# Altium schematic sheet De5.SchDoc
size A; SheetNumber: 1; SheetTotal: 1
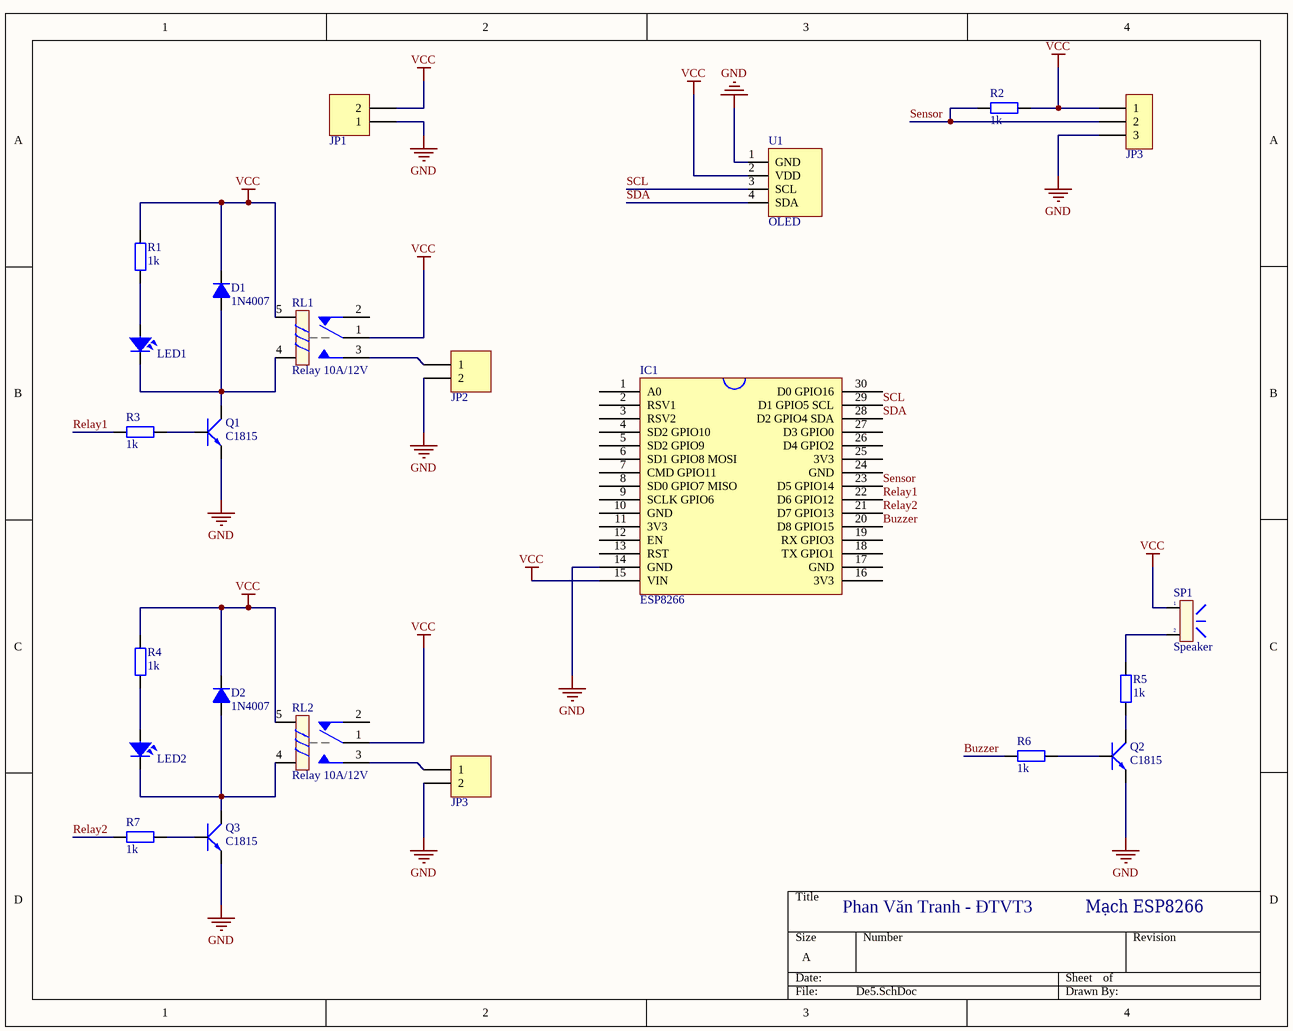
[diagram p0: De5.SchDoc]

## Parts
D1  1N4007  [D1A]
D2  1N4007  [D1A]
DHT11  JP3  [Header 3P DC 2.54]
IC1  ESP8266  [ESP8266 - duplicate]
JP1  Header 2_1  [HED2]  (value not drawn)
JP2  Header 2_1  [HED2]  (value not drawn)
JP3  Header 2_1  [HED2]  (value not drawn)
LED1  LED  [LED-3]  (value not drawn)
LED2  LED  [LED-3]  (value not drawn)
Q1  C1815  [TO92]
Q2  C1815  [TO92]
Q3  C1815  [TO92]
R1  1k  [tro vach 1/4w]
R2  1k  [tro vach 1/4w]
R3  1k  [tro vach 1/4w]
R4  1k  [tro vach 1/4w]
R5  1k  [tro vach 1/4w]
R6  1k  [tro vach 1/4w]
R7  1k  [tro vach 1/4w]
RL1  Relay 10A/12V  [RL_SPDT_10A]
RL2  Relay 10A/12V  [RL_SPDT_10A]
SP1  Speaker  [SPK]
U1  OLED  [OLED1306]

## Nets
GND: DHT11.3 IC1.14(GND) JP1.1 JP2.2 JP3.2 Q1.1(E) Q2.1(E) Q3.1(E) U1.1(GND)
VCC: D1.2(K) D2.2(K) DHT11.1 IC1.15(VIN) JP1.2 R1.1 R2.2 R4.1 RL1.1 RL1.5 RL2.1 RL2.5 SP1.1 U1.2(VDD)
Buzzer: IC1.20(D8_GPIO15) R6.1
Relay1: IC1.22(D6_GPIO12) R3.1
Relay2: IC1.21(D7_GPIO13) R7.1
SCL: IC1.29(D1_GPIO5_SCL) U1.3(SCL)
SDA: IC1.28(D2_GPIO4_SDA) U1.4(SDA)
Sensor: DHT11.2 IC1.23(D5_GPIO14) R2.1
NetD1_1: D1.1(A) LED1.2 Q1.2(C) RL1.4
NetD2_1: D2.1(A) LED2.2 Q3.2(C) RL2.4
NetJP2_1: JP2.1 RL1.3
NetJP3_1: JP3.1 RL2.3
NetLED1_1: LED1.1 R1.2
NetLED2_1: LED2.1 R4.2
NetQ1_3: Q1.3(B) R3.2
NetQ2_2: Q2.2(C) R5.2
NetQ2_3: Q2.3(B) R6.2
NetQ3_3: Q3.3(B) R7.2
NetR5_1: R5.1 SP1.2

Not connected (* = marked no-connect by the designer): IC1 1(A0) 2(RSV1) 3(RSV2) 4(SD2_GPIO10) 5(SD2_GPIO9) 6(SD1_GPIO8_MOSI) 7(CMD_GPIO11) 8(SD0_GPIO7_MISO) 9(SCLK_GPIO6) 10(GND) 11(3V3) 12(EN) 13(RST) 16(3V3) 17(GND) 18(TX_GPIO1) 19(RX_GPIO3) 24(GND) 25(3V3) 26(D4_GPIO2) 27(D3_GPIO0) 30(D0_GPIO16); RL1 2; RL2 2

## Notes on the sheet
- Phan Văn Tranh - ĐTVT3
- Mạch ESP8266

## Library data of the parts
D1 D2 = D1A: Diode 1A; Value: 1N4007
DHT11 = Header 3P 2.54 Duc Cong: Cắm; Ten_Linh_Kien: Header 3P XH2.54-3P Đực Cong; Don_Vi: Con; Ma_Hang: MH001302; Chung_Loai: Cắm
JP1-JP3 = Header 2_1: Header, 2-Pin; Manufacturer: Generic Components; Class: Connector; Value: Header 2
LED1 LED2 = LED: LED Single colour Green and Red; Value: LED 3 ly Single Colour
Q1-Q3 = Trans C1815 DIP: NPN transistor; Value: C9014
R1-R7 = Tro Vach 1/4W 5% 1k: Cắm; Don_Vi: Con; So_Chan: 2; Ten_Linh_Kien: Trở Vạch 1/4w 5% 1k; Ma_Hang: MH007390; Chung_Loai: Cắm; Kieu_Chan: *
RL1 RL2 = Relay 1: Relay SPDT,10A - 12VDC 5 Pin; Value: Relay SPDT, 10A, 12V
SP1 = SPK: Speaker Chip; Value: Speaker Chip
U1 = OLED1306